# Altium schematic sheet Servos_DC_converter.SchDoc
size A3; SheetNumber: 3; SheetTotal: 6
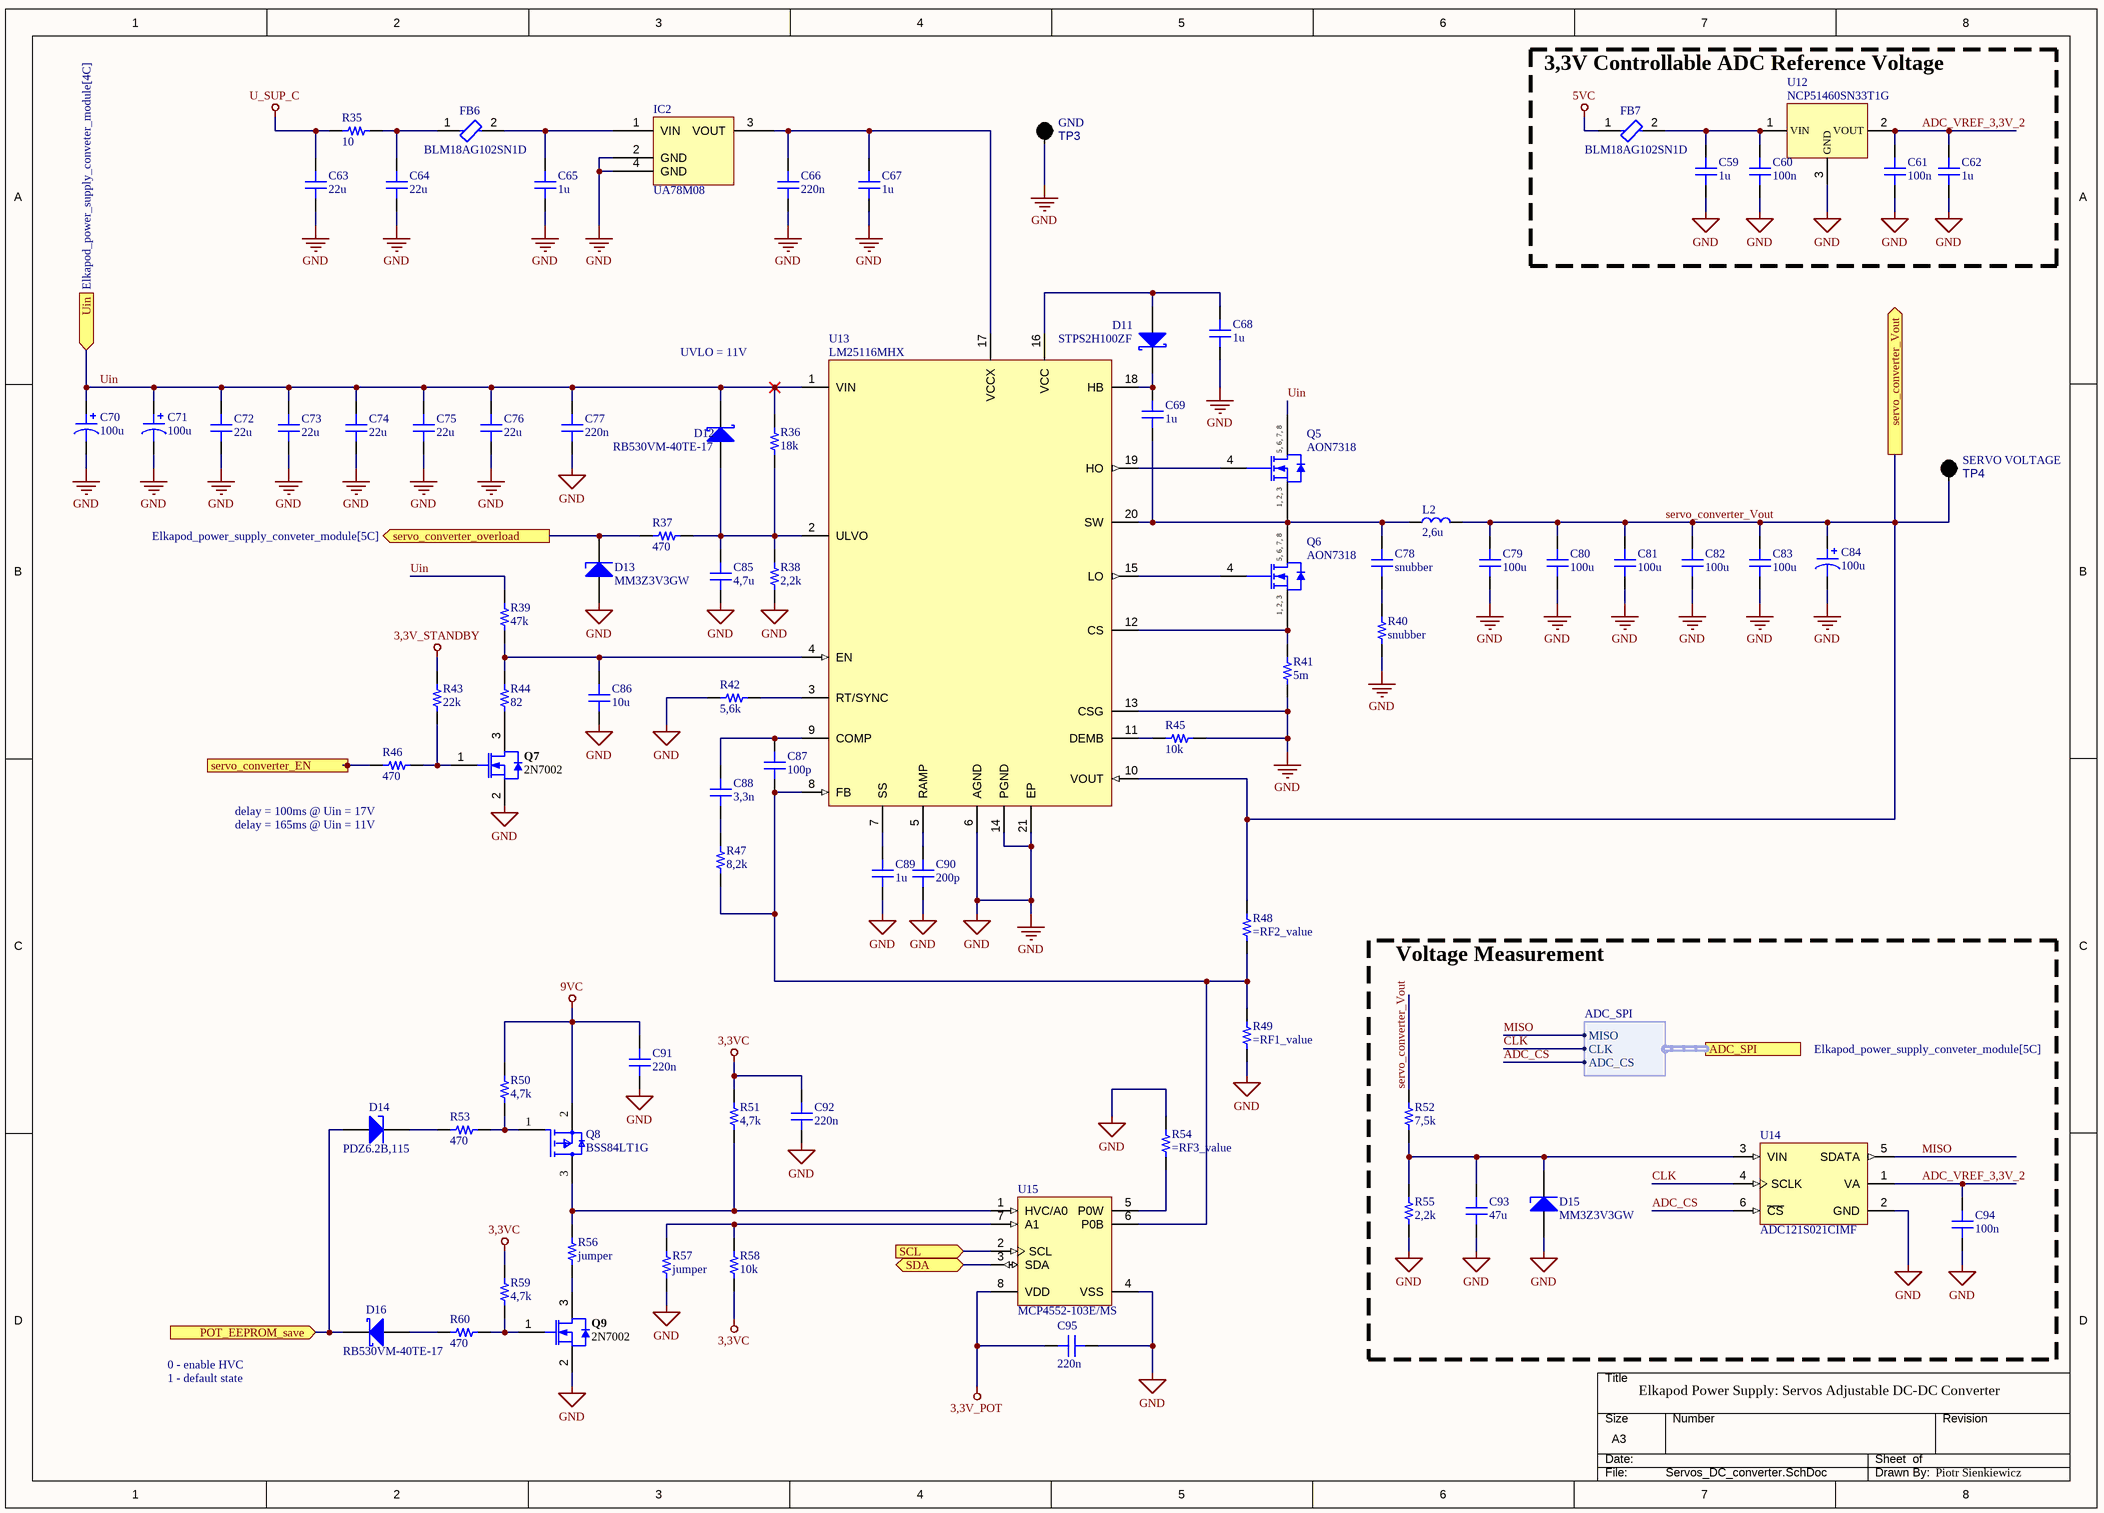
[diagram p0: Servos_DC_converter.SchDoc]

## Parts
C59  1u  [CAP 0603_1608]
C60  100n  [CAP 0603_1608]
C61  100n  [CAP 0603_1608]
C62  1u  [CAP 0603_1608]
C63  22u  [CAP 0805_2012]
C64  22u  [CAP 0805_2012]
C65  1u  [CAP 0603_1608]
C66  220n  [CAP 0603_1608]
C67  1u  [CAP 0603_1608]
C68  1u  [CAP 0603_1608]
C69  1u  [CAP 0603_1608]
C70  100u  [CAP ALSMD 8.3MM H10.5MM]
C71  100u  [CAP ALSMD 8.3MM H10.5MM]
C72  22u  [CAP 0805_2012]
C73  22u  [CAP 0805_2012]
C74  22u  [CAP 0805_2012]
C75  22u  [CAP 0805_2012]
C76  22u  [CAP 0805_2012]
C77  220n  [CAP 0603_1608]
C78  snubber  [CAP 0603_1608]
C79  100u  [CAP 1210_3225 - 1MM]
C80  100u  [CAP 1210_3225 - 1MM]
C81  100u  [CAP 1210_3225 - 1MM]
C82  100u  [CAP 1210_3225 - 1MM]
C83  100u  [CAP 1210_3225 - 1MM]
C84  100u  [CAP ALSMD 8.3MM H10.5MM]
C85  4,7u  [CAP 0603_1608]
C86  10u  [CAP 0603_1608]
C87  100p  [CAP 0603_1608]
C88  3,3n  [CAP 0603_1608]
C89  1u  [CAP 0603_1608]
C90  200p  [CAP 0603_1608]
C91  220n  [CAP 0603_1608]
C92  220n  [CAP 0603_1608]
C93  47u  [CAP 0603_1608]
C94  100n  [CAP 0603_1608]
C95  220n  [CAP 0603_1608]
D11  STPS2H100ZF  [DIOD-SOD-123-2_V]
D12  RB530VM-40TE-17  [SOD-323]
D13  MM3Z3V3GW  [SOD323]
D14  PDZ6.2B,115  [SOD323]
D15  MM3Z3V3GW  [SOD323]
D16  RB530VM-40TE-17  [SOD-323]
FB6  BLM18AG102SN1D  [FP-BLM18-0_15-t0_8-MFG]
FB7  BLM18AG102SN1D  [FP-BLM18-0_15-t0_8-MFG]
IC2  UA78M08  [TI SOT-223 DCY]
L2  2,6u  [18,3x18,2_INDUCTOR]
Q5  AON7318  [DFN3,3x3,3]
Q6  AON7318  [DFN3,3x3,3]
Q7  2N7002  [INF-PG-SOT23_M]
Q8  BSS84LT1G  [FP-318-08-IPC_A]
Q9  2N7002  [INF-PG-SOT23_M]
R35  10  [RES 1206_3216]
R36  18k  [RES 0603_1608]
R37  470  [RES 0603_1608]
R38  2,2k  [RES 0603_1608]
R39  47k  [RES 0603_1608]
R40  snubber  [RES 1206_3216]
R41  5m  [STACKPOLE CSM2512]
R42  5,6k  [RES 0603_1608]
R43  22k  [RES 0603_1608]
R44  82  [RES 0603_1608]
R45  10k  [RES 0603_1608]
R46  470  [RES 0603_1608]
R47  8,2k  [RES 0603_1608]
R48  (no value)  [RES 0603_1608]
R49  (no value)  [RES 0603_1608]
R50  4,7k  [RES 0603_1608]
R51  4,7k  [RES 0603_1608]
R52  7,5k  [RES 0603_1608]
R53  470  [RES 0603_1608]
R54  (no value)  [RES 0603_1608]
R55  2,2k  [RES 0603_1608]
R56  jumper  [RES 0603_1608]
R57  jumper  [RES 0603_1608]
R58  10k  [RES 0603_1608]
R59  4,7k  [RES 0603_1608]
R60  470  [RES 0603_1608]
TP3  GND  [Keystone_5006_BLACK]
TP4  SERVO VOLTAGE  [Keystone_5006_BLACK]
U12  NCP51460SN33T1G  [SOT23-3]
U13  LM25116MHX  [PWP0020A_M]
U14  ADC121S021CIMF  [DBV0006A_M]
U15  MCP4552-103E/MS  [MSOP-MS8_M]

## Blocks framed on the sheet
3,3V Controllable ADC Reference Voltage: C59-C62 FB7 U12
Voltage Measurement: C93 C94 D15 R52 R55 U14

## Ports
ADC_SPI (harness ADC_SPI, see Elkapod_power_supply_conveter_module[5C]), POT_EEPROM_save (in, see Elkapod_power_supply_conveter_module[4C]), SCL (in, see Elkapod_power_supply_conveter_module[4C]), SDA (bidir, see Elkapod_power_supply_conveter_module[4C]), servo_converter_EN (in, see Elkapod_power_supply_conveter_module[4C]), servo_converter_overload (out, see Elkapod_power_supply_conveter_module[5C]), servo_converter_Vout (out, see Elkapod_power_supply_conveter_module[5C]), Uin (in, see Elkapod_power_supply_conveter_module[4C])

## Harnesses
ADC_SPI: MISO, CLK, ADC_CS

## Nets
3,3V_POT: C95.2 U15.8(VDD)
3,3V_STANDBY: R43.1
3,3VC: C92.1 R51.1 R58.2 R59.1
5VC: FB7.1
9VC: C91.1 Q8.2(S) R50.1
GND: C59.1 C60.1 C61.1 C62.1 C63.1 C64.1 C65.1 C66.1 C67.1 C68.2 C70.2 C71.2 C72.1 C73.1 C74.1 C75.1 C76.1 C77.1 C79.1 C80.1 C81.1 C82.1 C83.1 C84.2 C85.1 C86.1 C89.1 C90.1 C91.2 C92.2 C93.1 C94.1 C95.1 D13.1(A) D15.1(A) IC2.2(GND) IC2.4(GND) Q7.2(SOURCE) Q9.2(SOURCE) R38.1 R40.1 R41.1 R42.2 R45.1 R49.2 R54.1 R55.2 R57.2 TP3.0 U12.3(GND) U13.6(AGND) U13.13(CSG) U13.14(PGND) U13.21(EP) U14.2(GND) U15.4(VSS)
U_SUP_C: C63.2 R35.1
ADC_CS: U14.6(~{CS}) ; port ADC_SPI.ADC_CS
ADC_VREF_3,3V_2: C61.2 C62.2 C94.2 U12.2(VOUT) U14.1(VA)
CLK: U14.4(SCLK) ; port ADC_SPI.CLK
MISO: U14.5(SDATA) ; port ADC_SPI.MISO
POT_EEPROM_save: D14.1(A) D16.1(K) ; port POT_EEPROM_save
SCL: U15.2(SCL) ; port SCL
SDA: U15.3(SDA) ; port SDA
servo_converter_EN: R46.1 ; port servo_converter_EN
servo_converter_overload: D13.2(K) R37.2 ; port servo_converter_overload
servo_converter_Vout: C79.2 C80.2 C81.2 C82.2 C83.2 C84.1 L2.2 R48.1 R52.1 TP4.0 U13.10(VOUT) ; port servo_converter_Vout
Uin: C70.1 C71.1 C72.2 C73.2 C74.2 C75.2 C76.2 C77.2 D12.1(K) Q5.5(D) R36.1 R39.1 U13.1(VIN) ; port Uin
NetC59_2: C59.2 C60.2 FB7.2 U12.1(VIN)
NetC64_2: C64.2 FB6.1 R35.2
NetC65_2: C65.2 FB6.2 IC2.1(VIN)
NetC66_2: C66.2 C67.2 IC2.3(VOUT) U13.17(VCCX)
NetC68_1: C68.1 D11.1(A) U13.16(VCC)
NetC69_1: C69.1 C78.2 L2.1 Q5.1(S) Q6.5(D) U13.20(SW)
NetC69_2: C69.2 D11.2(K) U13.18(HB)
NetC78_1: C78.1 R40.2
NetC85_2: C85.2 D12.2(A) R36.2 R37.1 R38.2 U13.2(ULVO)
NetC86_2: C86.2 R39.2 R44.1 U13.4(EN)
NetC87_1: C87.1 C88.1 U13.9(COMP)
NetC87_2: C87.2 R47.2 R48.2 R49.1 U13.8(FB) U15.6(P0B)
NetC88_2: C88.2 R47.1
NetC89_2: C89.2 U13.7(SS)
NetC90_2: C90.2 U13.5(RAMP)
NetC93_2: C93.2 D15.2(K) R52.2 R55.1 U14.3(VIN)
NetD14_2: D14.2(K) R53.2
NetD16_2: D16.2(A) R60.2
NetQ5_4: Q5.4(G) U13.19(HO)
NetQ6_1: Q6.1(S) R41.2 U13.12(CS)
NetQ6_4: Q6.4(G) U13.15(LO)
NetQ7_1: Q7.1(GATE) R43.2 R46.2
NetQ7_3: Q7.3(DRAIN) R44.2
NetQ8_1: Q8.1(G) R50.2 R53.1
NetQ8_3: Q8.3(D) R51.2 R56.1 U15.1(HVC/A0)
NetQ9_1: Q9.1(GATE) R59.2 R60.1
NetQ9_3: Q9.3(DRAIN) R56.2
NetR42_1: R42.1 U13.3(RT/SYNC)
NetR45_2: R45.2 U13.11(DEMB)
NetR54_2: R54.2 U15.5(P0W)
NetR57_1: R57.1 R58.1 U15.7(A1)

## Notes on the sheet
- UVLO = 11V
- (near R46) delay = 100ms @ Uin = 17V
- delay = 165ms @ Uin = 11V
- 0 - enable HVC
- 1 - default state
- Elkapod Power Supply: Servos Adjustable DC-DC Converter
- Piotr Sienkiewicz
- DWG. NO.
- REV.
- SHT.
- THIS DOCUMENT AND THE DATA DISCLOSED HEREIN OR HEREWITH IS THE PROPERTY OF ALTIUM LIMITED AND MAY BE FREELY DISTRIBUTED IN WHOLE. NO RIGHTS ARE RESERVED OR EXPRESS OR IMPLIED WARANTEE GIVEN.
- REVISION
- DESCRIPTION
- DATE
- APPROVED
- ENG:
- APPROVALS
- PROJECT
- DSN:
- CHK:
- REFERENCE DOCUMENTS
- PROJECT REVISION:
- TITLE
- DOCUMENT REVISION:
- DESIGN ITEM:
- BOM:
- FAB DWG:
- PCB DWG:
- ASSY DWG:
- SCALE:
- SIZE
- B
- CAGE CODE
- FILE NAME
- DWG NO.
- SHEET
- OF
- REV
- (in symbol AON7318) 5, 6, 7, 8; 1, 2, 3

## Library data of the parts
C59 C62 C89 = C0603C272F3GAC7867: CAP CER 1uF 16V X5R 0603; manufacturer: KEMET; Temperature Coefficient: C0G, NP0; Tolerance: ±1%; Voltage - Rated: 25V; Part Number: C0603C272F3GAC7867; Value: 1u; Applications: General Purpose; Capacitance: 1u; componentlink1description: Datasheet; componentlink1url: https://api.kemet.com/component-edge/download/datasheet/C0603C272F3GACTU.pdf; componentlink2description: DigiKey Link; componentlink2url: https://www.digikey.com/en/products/detail/kemet/C0603C272F3GAC7867/2200413; Device Package: 0603 (1608 Metric); Features: Low ESL; lastupdated: 09.02.2024 20:10:30; Lifecycle Status: Active; Minimum Order: 1; Mounting Type: Surface Mount, MLCC; Operating Temperature: -55°C ~ 125°C; Package / Case: 0603 (1608 Metric); packaging: TapeAndReel; partid: 2138; Part Status: Active; price: 0.40; series: SMD Comm C0G; Size / Dimension: 0.063" L x 0.031" W (1.60mm x 0.80mm); Thickness (Max): 0.034" (0.87mm)
C60 C61 C94 = C0603C272F3GAC7867: CAP CER 100nF 25V X5R 0603; manufacturer: KEMET; Temperature Coefficient: C0G, NP0; Tolerance: ±1%; Part Number: C0603C272F3GAC7867; Value: 100n; Applications: General Purpose; Capacitance: 100n; componentlink1description: Datasheet; componentlink1url: https://api.kemet.com/component-edge/download/datasheet/C0603C272F3GACTU.pdf; componentlink2description: DigiKey Link; componentlink2url: https://www.digikey.com/en/products/detail/kemet/C0603C272F3GAC7867/2200413; Device Package: 0603 (1608 Metric); Features: Low ESL; lastupdated: 09.02.2024 20:10:30; Lifecycle Status: Active; Minimum Order: 1; Mounting Type: Surface Mount, MLCC; Operating Temperature: -55°C ~ 125°C; Package / Case: 0603 (1608 Metric); packaging: TapeAndReel; partid: 2138; Part Status: Active; price: 0.40; series: SMD Comm C0G; Size / Dimension: 0.063" L x 0.031" W (1.60mm x 0.80mm); Thickness (Max): 0.034" (0.87mm); Voltage - Rated: 25V
C63 C64 C72-C76 = VJ0805Y684KXQTW1BC: CAP CER 22UF 25V X7R 0805; manufacturer: Vishay Vitramon; Tolerance: ±10%; Voltage - Rated: 10V; Part Number: VJ0805Y684KXQTW1BC; Value: 22u; Applications: General Purpose; Capacitance: 22u; componentlink1description: Datasheet; componentlink1url: https://www.vishay.com/docs/28548/vjw1bcbascomseries.pdf; componentlink2description: DigiKey Link; componentlink2url: https://www.digikey.com/en/products/detail/vishay-vitramon/VJ0805Y684KXQTW1BC/8313569; Device Package: 0805 (2012 Metric); lastupdated: 09.02.2024 20:13:13; Lifecycle Status: Active; Minimum Order: 1; Mounting Type: Surface Mount, MLCC; Operating Temperature: -55°C ~ 125°C; Package / Case: 0805 (2012 Metric); packaging: TapeAndReel; partid: 57262; price: 0.05; series: VJ W1BC; Size / Dimension: 0.079" L x 0.049" W (2.00mm x 1.25mm); Temperature Coefficient: X7R; Thickness (Max): 0.053" (1.35mm)
C65 C67-C69 = C0603C272F3GAC7867: CAP CER 1uF 25V X5R 0603; manufacturer: KEMET; Temperature Coefficient: C0G, NP0; Tolerance: ±1%; Part Number: C0603C272F3GAC7867; Value: 1u; Applications: General Purpose; Capacitance: 1u; componentlink1description: Datasheet; componentlink1url: https://api.kemet.com/component-edge/download/datasheet/C0603C272F3GACTU.pdf; componentlink2description: DigiKey Link; componentlink2url: https://www.digikey.com/en/products/detail/kemet/C0603C272F3GAC7867/2200413; Device Package: 0603 (1608 Metric); Features: Low ESL; lastupdated: 09.02.2024 20:10:30; Lifecycle Status: Active; Minimum Order: 1; Mounting Type: Surface Mount, MLCC; Operating Temperature: -55°C ~ 125°C; Package / Case: 0603 (1608 Metric); packaging: TapeAndReel; partid: 2138; Part Status: Active; price: 0.40; series: SMD Comm C0G; Size / Dimension: 0.063" L x 0.031" W (1.60mm x 0.80mm); Thickness (Max): 0.034" (0.87mm); Voltage - Rated: 25V
C66 C77 C91 C92 C95 = C0603C272F3GAC7867: CAP CER 220nF 25V X5R 0603; manufacturer: KEMET; Temperature Coefficient: C0G, NP0; Tolerance: ±1%; Part Number: C0603C272F3GAC7867; Value: 220n; Applications: General Purpose; Capacitance: 220n; componentlink1description: Datasheet; componentlink1url: https://api.kemet.com/component-edge/download/datasheet/C0603C272F3GACTU.pdf; componentlink2description: DigiKey Link; componentlink2url: https://www.digikey.com/en/products/detail/kemet/C0603C272F3GAC7867/2200413; Device Package: 0603 (1608 Metric); Features: Low ESL; lastupdated: 09.02.2024 20:10:30; Lifecycle Status: Active; Minimum Order: 1; Mounting Type: Surface Mount, MLCC; Operating Temperature: -55°C ~ 125°C; Package / Case: 0603 (1608 Metric); packaging: TapeAndReel; partid: 2138; Part Status: Active; price: 0.40; series: SMD Comm C0G; Size / Dimension: 0.063" L x 0.031" W (1.60mm x 0.80mm); Thickness (Max): 0.034" (0.87mm); Voltage - Rated: 25V
C70 C71 C84 = EEE-TC1C101P: UCD1V101MNL1GS; CAP ALUM 100UF 20% 16V SMD; value: 100u
C78 = C0603C272F3GAC7867: CAP CER 50V X5R 0603; manufacturer: KEMET; Temperature Coefficient: C0G, NP0; Tolerance: ±1%; Voltage - Rated: 25V; Part Number: C0603C272F3GAC7867; Value: snubber; Applications: General Purpose; Capacitance: snubber; componentlink1description: Datasheet; componentlink1url: https://api.kemet.com/component-edge/download/datasheet/C0603C272F3GACTU.pdf; componentlink2description: DigiKey Link; componentlink2url: https://www.digikey.com/en/products/detail/kemet/C0603C272F3GAC7867/2200413; Device Package: 0603 (1608 Metric); Features: Low ESL; lastupdated: 09.02.2024 20:10:30; Lifecycle Status: Active; Minimum Order: 1; Mounting Type: Surface Mount, MLCC; Operating Temperature: -55°C ~ 125°C; Package / Case: 0603 (1608 Metric); packaging: TapeAndReel; partid: 2138; Part Status: Active; price: 0.40; series: SMD Comm C0G; Size / Dimension: 0.063" L x 0.031" W (1.60mm x 0.80mm); Thickness (Max): 0.034" (0.87mm)
C79-C83 = CAN13X104KARAC7800: CAP CER 1210 100UF 10V X7R; manufacturer: KEMET; Tolerance: ±10%; Voltage - Rated: 250VAC; Part Number: CAN13X104KARAC7800; Value: 100u; Applications: Boardflex Sensitive; Capacitance: 100u; componentlink1description: Datasheet; componentlink1url: //media.digikey.com/pdf/Data%20Sheets/Kemet%20PDFs/CAN13X104KARACTU_Spec.pdf; componentlink2description: DigiKey Link; componentlink2url: https://www.digikey.com/en/products/detail/kemet/CAN13X104KARAC7800/9962480; Device Package: 1210 (3225 Metric); Features: Low ESL, Soft Termination; lastupdated: 04.06.2024 19:21:07; Lifecycle Status: Active; Minimum Order: 1; Mounting Type: Surface Mount, MLCC; Operating Temperature: -55°C ~ 125°C; Package / Case: 1210 (3225 Metric); packaging: TapeAndReel; partid: 23615; Part Status: Active; price: 0.39; series: CAN SMD Indust X7R; Size / Dimension: 0.130" L x 0.102" W (3.30mm x 2.60mm); Temperature Coefficient: X7R; Thickness (Max): 0.110" (2.80mm)
C85 = C0603C272F3GAC7867: CAP CER 4,7uF 25V X5R 0603; manufacturer: KEMET; Temperature Coefficient: C0G, NP0; Tolerance: ±1%; Part Number: C0603C272F3GAC7867; Value: 4,7u; Applications: General Purpose; Capacitance: 4,7u; componentlink1description: Datasheet; componentlink1url: https://api.kemet.com/component-edge/download/datasheet/C0603C272F3GACTU.pdf; componentlink2description: DigiKey Link; componentlink2url: https://www.digikey.com/en/products/detail/kemet/C0603C272F3GAC7867/2200413; Device Package: 0603 (1608 Metric); Features: Low ESL; lastupdated: 09.02.2024 20:10:30; Lifecycle Status: Active; Minimum Order: 1; Mounting Type: Surface Mount, MLCC; Operating Temperature: -55°C ~ 125°C; Package / Case: 0603 (1608 Metric); packaging: TapeAndReel; partid: 2138; Part Status: Active; price: 0.40; series: SMD Comm C0G; Size / Dimension: 0.063" L x 0.031" W (1.60mm x 0.80mm); Thickness (Max): 0.034" (0.87mm); Voltage - Rated: 25V
C86 = C0603C272F3GAC7867: CAP CER 10uF 35V X5R 0603; manufacturer: KEMET; Temperature Coefficient: C0G, NP0; Tolerance: ±1%; Voltage - Rated: 25V; Part Number: C0603C272F3GAC7867; Value: 10u; Applications: General Purpose; Capacitance: 10u; componentlink1description: Datasheet; componentlink1url: https://api.kemet.com/component-edge/download/datasheet/C0603C272F3GACTU.pdf; componentlink2description: DigiKey Link; componentlink2url: https://www.digikey.com/en/products/detail/kemet/C0603C272F3GAC7867/2200413; Device Package: 0603 (1608 Metric); Features: Low ESL; lastupdated: 09.02.2024 20:10:30; Lifecycle Status: Active; Minimum Order: 1; Mounting Type: Surface Mount, MLCC; Operating Temperature: -55°C ~ 125°C; Package / Case: 0603 (1608 Metric); packaging: TapeAndReel; partid: 2138; Part Status: Active; price: 0.40; series: SMD Comm C0G; Size / Dimension: 0.063" L x 0.031" W (1.60mm x 0.80mm); Thickness (Max): 0.034" (0.87mm)
C87 = C0603C272F3GAC7867: CAP CER 100pF 50V G0C 0603; manufacturer: KEMET; Temperature Coefficient: C0G, NP0; Tolerance: ±1%; Voltage - Rated: 25V; Part Number: C0603C272F3GAC7867; Value: 100p; Applications: General Purpose; Capacitance: 100p; componentlink1description: Datasheet; componentlink1url: https://api.kemet.com/component-edge/download/datasheet/C0603C272F3GACTU.pdf; componentlink2description: DigiKey Link; componentlink2url: https://www.digikey.com/en/products/detail/kemet/C0603C272F3GAC7867/2200413; Device Package: 0603 (1608 Metric); Features: Low ESL; lastupdated: 09.02.2024 20:10:30; Lifecycle Status: Active; Minimum Order: 1; Mounting Type: Surface Mount, MLCC; Operating Temperature: -55°C ~ 125°C; Package / Case: 0603 (1608 Metric); packaging: TapeAndReel; partid: 2138; Part Status: Active; price: 0.40; series: SMD Comm C0G; Size / Dimension: 0.063" L x 0.031" W (1.60mm x 0.80mm); Thickness (Max): 0.034" (0.87mm)
C88 = C0603C272F3GAC7867: CAP CER 3,3nF 50V G0C 0603; manufacturer: KEMET; Temperature Coefficient: C0G, NP0; Tolerance: ±1%; Voltage - Rated: 25V; Part Number: C0603C272F3GAC7867; Value: 3,3n; Applications: General Purpose; Capacitance: 3,3n; componentlink1description: Datasheet; componentlink1url: https://api.kemet.com/component-edge/download/datasheet/C0603C272F3GACTU.pdf; componentlink2description: DigiKey Link; componentlink2url: https://www.digikey.com/en/products/detail/kemet/C0603C272F3GAC7867/2200413; Device Package: 0603 (1608 Metric); Features: Low ESL; lastupdated: 09.02.2024 20:10:30; Lifecycle Status: Active; Minimum Order: 1; Mounting Type: Surface Mount, MLCC; Operating Temperature: -55°C ~ 125°C; Package / Case: 0603 (1608 Metric); packaging: TapeAndReel; partid: 2138; Part Status: Active; price: 0.40; series: SMD Comm C0G; Size / Dimension: 0.063" L x 0.031" W (1.60mm x 0.80mm); Thickness (Max): 0.034" (0.87mm)
C90 = C0603C272F3GAC7867: CAP CER 200pF 50V G0C 0603; manufacturer: KEMET; Temperature Coefficient: C0G, NP0; Tolerance: ±1%; Voltage - Rated: 25V; Part Number: C0603C272F3GAC7867; Value: 200p; Applications: General Purpose; Capacitance: 200p; componentlink1description: Datasheet; componentlink1url: https://api.kemet.com/component-edge/download/datasheet/C0603C272F3GACTU.pdf; componentlink2description: DigiKey Link; componentlink2url: https://www.digikey.com/en/products/detail/kemet/C0603C272F3GAC7867/2200413; Device Package: 0603 (1608 Metric); Features: Low ESL; lastupdated: 09.02.2024 20:10:30; Lifecycle Status: Active; Minimum Order: 1; Mounting Type: Surface Mount, MLCC; Operating Temperature: -55°C ~ 125°C; Package / Case: 0603 (1608 Metric); packaging: TapeAndReel; partid: 2138; Part Status: Active; price: 0.40; series: SMD Comm C0G; Size / Dimension: 0.063" L x 0.031" W (1.60mm x 0.80mm); Thickness (Max): 0.034" (0.87mm)
C93 = C0603C272F3GAC7867: CAP CER 47uF 6,3V X5R 0603; manufacturer: KEMET; Temperature Coefficient: C0G, NP0; Tolerance: ±1%; Voltage - Rated: 25V; Part Number: C0603C272F3GAC7867; Value: 47u; Applications: General Purpose; Capacitance: 47u; componentlink1description: Datasheet; componentlink1url: https://api.kemet.com/component-edge/download/datasheet/C0603C272F3GACTU.pdf; componentlink2description: DigiKey Link; componentlink2url: https://www.digikey.com/en/products/detail/kemet/C0603C272F3GAC7867/2200413; Device Package: 0603 (1608 Metric); Features: Low ESL; lastupdated: 09.02.2024 20:10:30; Lifecycle Status: Active; Minimum Order: 1; Mounting Type: Surface Mount, MLCC; Operating Temperature: -55°C ~ 125°C; Package / Case: 0603 (1608 Metric); packaging: TapeAndReel; partid: 2138; Part Status: Active; price: 0.40; series: SMD Comm C0G; Size / Dimension: 0.063" L x 0.031" W (1.60mm x 0.80mm); Thickness (Max): 0.034" (0.87mm)
D11 = CMP-0303-00004-1: Schottky diode; 2A; 100V
D12 D16 = BAS140W: Schottky diode; 0,1A; 40V; Published: 21-Mar-2003; LatestRevisionDate: 19-Mar-2004; LatestRevisionNote: Silkscreen size reduced.; DatasheetDocument: Oct-1999; PackageDocument: Sep-2000; PackageReference: SOD-323; Publisher: Altium Limited; ComponentLink1Description: Manufacturer Link; ComponentLink1URL: http://www.infineon.com/; ComponentLink2Description: Datasheet; ComponentLink2URL: http://www.infineon.com/upload/Document/cmc_upload/documents/009/386/bas70_bas170series_1.pdf
D13 D15 = Zener_Diode_SOD323: 3,3V, 0,3W Zener diode; SOD323
D14 = Zener_Diode_SOD323: 6,2V, 0,4W Zener diode
FB6 FB7 = CMP-0686-00457-3: Chip Ferrite Bead, 0603, 1000Ω @ 100MHz, 0.5Ω, 25%, 450mA; Number of Circuits: 1; Max DC Current: 400mA; Shielding: Unshielded; DC Resistance (DCR): 500mR; Material: Steel; DC Resistance-Max: 700mR; Impedance: 1kR; Case Code (Imperial): 0603; Max Current Rating: 400mA; Frequency: 100MHz; Min Operating Temperature: -55°C; Case/Package: 0603; Depth: 0.8mm; Lead Free: Lead Free; Core Material: Ferrite; Current Rating: 400mA; Resistance: 500mR; Case Code (Metric): 1608; DC Current: 400mA; Package Quantity: 1; Packaging: Tape and Reel; Width: 0.8mm; Military Standard: Not; Height: 0.8mm; Series: BLM18A; Max Operating Temperature: 125°C; Tolerance: 25%; Termination: SMD/SMT; Test Frequency: 100MHz; Number of Lines: 1; Number of Pins: 2; REACH SVHC: No SVHC; Length: 1.6mm; Radiation Hardening: No
IC2 = LM340MP-5.0/NOPB: IC REG LINEAR 8V 0,5A SOT223; Manufacturer: Texas Instruments; Current - Output: 1.5A; Number of Regulators: 1; Output Configuration: Positive; Output Type: Fixed; Part Number: UA78M08; ComponentLink1Description: Datasheet; ComponentLink1URL: http://www.ti.com/general/docs/suppproductinfo.tsp?distId=10&gotoUrl=http%3A%2F%2Fwww.ti.com%2Flit%2Fgpn%2Flm340; ComponentLink2Description: DigiKey Link; ComponentLink2URL: //digikey.com/product-detail/en/texas-instruments/LM340MP-5.0-NOPB/LM340MP-5.0-NOPBTR-ND/270717; Lifecycle Status: 0; Operating Temperature: 0°C ~ 125°C; Package / Case: TO-261-4, TO-261AA; Packaging: TapeAndReel; Voltage - Output (Min/Fixed): 8V
L2 = 18,3x18,2_INDUCTOR: Power inductor, 2,6uH, Imax = 25,5A, Isat = 50A
Q5 Q6 = AON7318: Ultra Fast N-MOSFET; 50A; 30V; DFN3,3x3,3
Q7 Q9 = CMP-1149-00026-1: N-Channel OptiMOS Small-Signal-Transistor, 60 V VDS, 0.3 A ID, -55 to 150 degC, PG-SOT23, Reel, Green; Manufacturer: Infineon; RDS (on) (max) (@4.5V): 4,000 mOhm; VDS (max): 60 V; IDpuls (max): 1.2Â A; QG: 0.4Â nC; RDS (on) (max): 3,000 mOhm; RthJA (max): 250 K/W; ID (max): 0.3Â A; VGS(th) (max): 2.5Â V; VGS(th) (min): 1.5Â V; Green: TRUE; Ptot (max): 0.5Â W; PackageDescription: 3-Pin Small Outline Transistor Package, 2.9 x 1.3 mm Body, 0.95 mm Pitch; Halogen-free: TRUE; ComponentLink2Description: Datasheet; ComponentLink1URL: http://www.infineon.com/; Packing: Reel; DatasheetVersion: Rev. 2.4; PartNumber: 2N7002; PackageReference: PG-SOT23; PackageVersion: Apr-08; ComponentLink3URL: http://www.infineon.com/dgdl/SOT23-Package_Overview.pdf?folderId=db3a30431936bc4b0119532290053c66&fileId=db3a30431936bc4b0119533468123c85; ComponentLink1Description: Manufacturer URL; Mounting Technology: Surface Mount; ComponentLink3Description: Package Specification; ComponentLink2URL: http://www.infineon.com/dgdl/2N7002_Rev2.4.pdf?folderId=db3a3043156fd573011622e10b5c1f67&fileId=db3a304319bc939a0119c2a9461e79e6
Q8 = CMP-1058-00762-2: MOSFET P-CH 50V 130MA SOT-23; Max Power Dissipation: 225mW; On-State Resistance: 10R; Nominal Vgs: 2V; Gate to Source Voltage (Vgs): 20V; Rise Time: 1ns; Turn-Off Delay Time: 16ns; Voltage Rating (DC): -50V; Turn-On Delay Time: 3.6ns; Number of Elements: 1; Current Rating: -130mA; Input Capacitance: 30pF; Threshold Voltage: -2V; Element Configuration: Single; Drain to Source Breakdown Voltage: 50V; Continuous Drain Current (ID): 130mA; Length: 0.119inch; Drain to Source Voltage (Vdss): 50V; Min Operating Temperature: -55°C; Contact Plating: Tin; Lead Free: Lead Free; Width: 0.055inch; Case/Package: SOT-23-3; Max Operating Temperature: 150°C; Halogen Free: Halogen Free; Radiation Hardening: No; Drain to Source Resistance: 10R; REACH SVHC: No SVHC; Power Dissipation: 225mW; Number of Pins: 3; Package Quantity: 1; Packaging: Tape and Reel; Fall Time: 1ns; Rds On Max: 10R; Height: 0.04inch
R35 = KRL1632E-M-R120-F-T5: RES 10 OHM 1% 3/4W 1206; Manufacturer: Susumu; Power (Watts): 0.75W, 3/4W; Temperature Coefficient: ±50ppm/°C; Part Number: KRL1632E-M-R120-F-T5; ComponentLink1Description: Datasheet; ComponentLink1URL: http://www.susumu.co.jp/common/pdf/n_catalog_partition09_en.pdf; ComponentLink2Description: DigiKey Link; ComponentLink2URL: https://www.digikey.com/en/products/detail/susumu/KRL1632E-M-R120-F-T5/3738009; Composition: Metal Foil; Device Package: 1206 (3216 Metric); Features: Automotive AEC-Q200, Current Sense; Height - Seated (Max): 0.028" (0.70mm); LastUpdated: 09.02.2024 20:54:46; Lifecycle Status: Active; Minimum Order: 1; Number of Terminations: 2; Operating Temperature: -55°C ~ 155°C; Package / Case: 1206 (3216 Metric); Packaging: TapeAndReel; PartId: 26840; Part Status: Active; Price: 0.09; Ratings: AEC-Q200; Resistance: 10; Series: KRL; Size / Dimension: 0.126" L x 0.063" W (3.20mm x 1.60mm); Supplier Device Package: 1206; Tolerance: ±1%; Value: 10
R36 = RNCS0603BKE10K0: RES 18K OHM 1% 0,1W 0603; Manufacturer: Stackpole Electronics Inc; Power (Watts): 0.063W, 1/16W; Temperature Coefficient: ±25ppm/°C; Tolerance: ±0.1%; Part Number: RNCS0603BKE10K0; Value: 18k; Composition: Thin Film; Device Package: 0603 (1608 Metric); Features: Anti-Corrosive, Automotive AEC-Q200, Moisture Resistant; Height - Seated (Max): 0.022" (0.55mm); LastUpdated: 09.02.2024 20:43:37; Lifecycle Status: Active; Minimum Order: 1; Number of Terminations: 2; Operating Temperature: -55°C ~ 155°C; Package / Case: 0603 (1608 Metric); Packaging: TapeAndReel; PartId: 4838; Part Status: Active; Price: 0.06; Ratings: AEC-Q200; Resistance: 18k; Series: RNCS; Size / Dimension: 0.061" L x 0.031" W (1.55mm x 0.80mm); Supplier Device Package: 0603
R37 R46 R53 R60 = RNCS0603BKE10K0: RES 470 OHM 1% 0,1W 0603; Manufacturer: Stackpole Electronics Inc; Power (Watts): 0.063W, 1/16W; Temperature Coefficient: ±25ppm/°C; Tolerance: ±0.1%; Part Number: RNCS0603BKE10K0; Value: 470; Composition: Thin Film; Device Package: 0603 (1608 Metric); Features: Anti-Corrosive, Automotive AEC-Q200, Moisture Resistant; Height - Seated (Max): 0.022" (0.55mm); LastUpdated: 09.02.2024 20:43:37; Lifecycle Status: Active; Minimum Order: 1; Number of Terminations: 2; Operating Temperature: -55°C ~ 155°C; Package / Case: 0603 (1608 Metric); Packaging: TapeAndReel; PartId: 4838; Part Status: Active; Price: 0.06; Ratings: AEC-Q200; Resistance: 470; Series: RNCS; Size / Dimension: 0.061" L x 0.031" W (1.55mm x 0.80mm); Supplier Device Package: 0603
R38 R55 = RNCS0603BKE10K0: RES 2,2K OHM 1% 0,1W 0603; Manufacturer: Stackpole Electronics Inc; Power (Watts): 0.063W, 1/16W; Temperature Coefficient: ±25ppm/°C; Tolerance: ±0.1%; Part Number: RNCS0603BKE10K0; Value: 2,2k; Composition: Thin Film; Device Package: 0603 (1608 Metric); Features: Anti-Corrosive, Automotive AEC-Q200, Moisture Resistant; Height - Seated (Max): 0.022" (0.55mm); LastUpdated: 09.02.2024 20:43:37; Lifecycle Status: Active; Minimum Order: 1; Number of Terminations: 2; Operating Temperature: -55°C ~ 155°C; Package / Case: 0603 (1608 Metric); Packaging: TapeAndReel; PartId: 4838; Part Status: Active; Price: 0.06; Ratings: AEC-Q200; Resistance: 2,2k; Series: RNCS; Size / Dimension: 0.061" L x 0.031" W (1.55mm x 0.80mm); Supplier Device Package: 0603
R39 = RNCS0603BKE10K0: RES 47K OHM 1% 0,1W 0603; Manufacturer: Stackpole Electronics Inc; Power (Watts): 0.063W, 1/16W; Temperature Coefficient: ±25ppm/°C; Tolerance: ±0.1%; Part Number: RNCS0603BKE10K0; Value: 47k; Composition: Thin Film; Device Package: 0603 (1608 Metric); Features: Anti-Corrosive, Automotive AEC-Q200, Moisture Resistant; Height - Seated (Max): 0.022" (0.55mm); LastUpdated: 09.02.2024 20:43:37; Lifecycle Status: Active; Minimum Order: 1; Number of Terminations: 2; Operating Temperature: -55°C ~ 155°C; Package / Case: 0603 (1608 Metric); Packaging: TapeAndReel; PartId: 4838; Part Status: Active; Price: 0.06; Ratings: AEC-Q200; Resistance: 47k; Series: RNCS; Size / Dimension: 0.061" L x 0.031" W (1.55mm x 0.80mm); Supplier Device Package: 0603
R40 = KRL1632E-M-R120-F-T5: Manufacturer: Susumu; Power (Watts): 0.75W, 3/4W; Temperature Coefficient: ±50ppm/°C; Tolerance: ±1%; Part Number: KRL1632E-M-R120-F-T5; Composition: Metal Foil; Device Package: 1206 (3216 Metric); Features: Automotive AEC-Q200, Current Sense; Height - Seated (Max): 0.028" (0.70mm); LastUpdated: 09.02.2024 20:54:46; Lifecycle Status: Active; Minimum Order: 1; Number of Terminations: 2; Operating Temperature: -55°C ~ 155°C; Package / Case: 1206 (3216 Metric); Packaging: TapeAndReel; PartId: 26840; Part Status: Active; Price: 0.09; Ratings: AEC-Q200; Resistance: snubber; Series: KRL; Size / Dimension: 0.126" L x 0.063" W (3.20mm x 1.60mm); Supplier Device Package: 1206; Value: snubber
R41 = CSM2512FT20L0: RES 0,005 OHM 1% 3W 2512; manufacturer: Stackpole Electronics Inc; Temperature Coefficient: ±50ppm/°C; value: 20 mOhms; Part Number: CSM2512FT20L0; componentlink1description: Datasheet; componentlink1url: https://www.seielect.com/Catalog/SEI-CSM.PDF; componentlink2description: DigiKey Link; componentlink2url: https://www.digikey.com/en/products/detail/stackpole-electronics-inc/CSM2512FT20L0/6270239; Composition: Metal Element; Device Package: 2512 (6332 Metric); Features: Current Sense; Height - Seated (Max): 0.035" (0.90mm); lastupdated: 03.06.2024 20:27:03; Lifecycle Status: Active; Minimum Order: 4000; Number of Terminations: 2; Operating Temperature: -55°C ~ 170°C; Package / Case: 2512 (6332 Metric); packaging: TapeAndReel; Part Status: Active; Power (Watts): 3W; price: 0.19; Resistance: 5m; series: CSM; Size / Dimension: 0.252" L x 0.126" W (6.40mm x 3.20mm); Supplier Device Package: 2512; Tolerance: ±1%
R42 = RNCS0603BKE10K0: RES 5,6K OHM 1% 0,1W 0603; Manufacturer: Stackpole Electronics Inc; Power (Watts): 0.063W, 1/16W; Temperature Coefficient: ±25ppm/°C; Tolerance: ±0.1%; Part Number: RNCS0603BKE10K0; Value: 5,6k; Composition: Thin Film; Device Package: 0603 (1608 Metric); Features: Anti-Corrosive, Automotive AEC-Q200, Moisture Resistant; Height - Seated (Max): 0.022" (0.55mm); LastUpdated: 09.02.2024 20:43:37; Lifecycle Status: Active; Minimum Order: 1; Number of Terminations: 2; Operating Temperature: -55°C ~ 155°C; Package / Case: 0603 (1608 Metric); Packaging: TapeAndReel; PartId: 4838; Part Status: Active; Price: 0.06; Ratings: AEC-Q200; Resistance: 5,6k; Series: RNCS; Size / Dimension: 0.061" L x 0.031" W (1.55mm x 0.80mm); Supplier Device Package: 0603
R43 = RNCS0603BKE10K0: RES 22K OHM 1% 0,1W 0603; Manufacturer: Stackpole Electronics Inc; Power (Watts): 0.063W, 1/16W; Temperature Coefficient: ±25ppm/°C; Tolerance: ±0.1%; Part Number: RNCS0603BKE10K0; Value: 22k; Composition: Thin Film; Device Package: 0603 (1608 Metric); Features: Anti-Corrosive, Automotive AEC-Q200, Moisture Resistant; Height - Seated (Max): 0.022" (0.55mm); LastUpdated: 09.02.2024 20:43:37; Lifecycle Status: Active; Minimum Order: 1; Number of Terminations: 2; Operating Temperature: -55°C ~ 155°C; Package / Case: 0603 (1608 Metric); Packaging: TapeAndReel; PartId: 4838; Part Status: Active; Price: 0.06; Ratings: AEC-Q200; Resistance: 22k; Series: RNCS; Size / Dimension: 0.061" L x 0.031" W (1.55mm x 0.80mm); Supplier Device Package: 0603
R44 = RNCS0603BKE10K0: RES 82 OHM 1% 0,1W 0603; Manufacturer: Stackpole Electronics Inc; Power (Watts): 0.063W, 1/16W; Temperature Coefficient: ±25ppm/°C; Tolerance: ±0.1%; Part Number: RNCS0603BKE10K0; Value: 82; Composition: Thin Film; Device Package: 0603 (1608 Metric); Features: Anti-Corrosive, Automotive AEC-Q200, Moisture Resistant; Height - Seated (Max): 0.022" (0.55mm); LastUpdated: 09.02.2024 20:43:37; Lifecycle Status: Active; Minimum Order: 1; Number of Terminations: 2; Operating Temperature: -55°C ~ 155°C; Package / Case: 0603 (1608 Metric); Packaging: TapeAndReel; PartId: 4838; Part Status: Active; Price: 0.06; Ratings: AEC-Q200; Resistance: 82; Series: RNCS; Size / Dimension: 0.061" L x 0.031" W (1.55mm x 0.80mm); Supplier Device Package: 0603
R45 R58 = RNCS0603BKE10K0: RES 10K OHM 1% 0,1W 0603; Manufacturer: Stackpole Electronics Inc; Power (Watts): 0.063W, 1/16W; Temperature Coefficient: ±25ppm/°C; Tolerance: ±0.1%; Part Number: RNCS0603BKE10K0; Value: 10k; Composition: Thin Film; Device Package: 0603 (1608 Metric); Features: Anti-Corrosive, Automotive AEC-Q200, Moisture Resistant; Height - Seated (Max): 0.022" (0.55mm); LastUpdated: 09.02.2024 20:43:37; Lifecycle Status: Active; Minimum Order: 1; Number of Terminations: 2; Operating Temperature: -55°C ~ 155°C; Package / Case: 0603 (1608 Metric); Packaging: TapeAndReel; PartId: 4838; Part Status: Active; Price: 0.06; Ratings: AEC-Q200; Resistance: 10k; Series: RNCS; Size / Dimension: 0.061" L x 0.031" W (1.55mm x 0.80mm); Supplier Device Package: 0603
R47 = RNCS0603BKE10K0: RES 8,2K OHM 1% 0,1W 0603; Manufacturer: Stackpole Electronics Inc; Power (Watts): 0.063W, 1/16W; Temperature Coefficient: ±25ppm/°C; Tolerance: ±0.1%; Part Number: RNCS0603BKE10K0; Value: 8,2k; Composition: Thin Film; Device Package: 0603 (1608 Metric); Features: Anti-Corrosive, Automotive AEC-Q200, Moisture Resistant; Height - Seated (Max): 0.022" (0.55mm); LastUpdated: 09.02.2024 20:43:37; Lifecycle Status: Active; Minimum Order: 1; Number of Terminations: 2; Operating Temperature: -55°C ~ 155°C; Package / Case: 0603 (1608 Metric); Packaging: TapeAndReel; PartId: 4838; Part Status: Active; Price: 0.06; Ratings: AEC-Q200; Resistance: 8,2k; Series: RNCS; Size / Dimension: 0.061" L x 0.031" W (1.55mm x 0.80mm); Supplier Device Package: 0603
R48 = RNCS0603BKE10K0: RES {=RF2_value} OHM 1% 0,1W 0603; Manufacturer: Stackpole Electronics Inc; Power (Watts): 0.063W, 1/16W; Temperature Coefficient: ±25ppm/°C; Tolerance: ±0.1%; Part Number: RNCS0603BKE10K0; Value: =RF2_value; Composition: Thin Film; Device Package: 0603 (1608 Metric); Features: Anti-Corrosive, Automotive AEC-Q200, Moisture Resistant; Height - Seated (Max): 0.022" (0.55mm); LastUpdated: 09.02.2024 20:43:37; Lifecycle Status: Active; Minimum Order: 1; Number of Terminations: 2; Operating Temperature: -55°C ~ 155°C; Package / Case: 0603 (1608 Metric); Packaging: TapeAndReel; PartId: 4838; Part Status: Active; Price: 0.06; Ratings: AEC-Q200; Resistance: =RF2_value; Series: RNCS; Size / Dimension: 0.061" L x 0.031" W (1.55mm x 0.80mm); Supplier Device Package: 0603
R49 = RNCS0603BKE10K0: RES {=RF1_value} OHM 1% 0,1W 0603; Manufacturer: Stackpole Electronics Inc; Power (Watts): 0.063W, 1/16W; Temperature Coefficient: ±25ppm/°C; Tolerance: ±0.1%; Part Number: RNCS0603BKE10K0; Value: =RF1_value; Composition: Thin Film; Device Package: 0603 (1608 Metric); Features: Anti-Corrosive, Automotive AEC-Q200, Moisture Resistant; Height - Seated (Max): 0.022" (0.55mm); LastUpdated: 09.02.2024 20:43:37; Lifecycle Status: Active; Minimum Order: 1; Number of Terminations: 2; Operating Temperature: -55°C ~ 155°C; Package / Case: 0603 (1608 Metric); Packaging: TapeAndReel; PartId: 4838; Part Status: Active; Price: 0.06; Ratings: AEC-Q200; Resistance: =RF1_value; Series: RNCS; Size / Dimension: 0.061" L x 0.031" W (1.55mm x 0.80mm); Supplier Device Package: 0603
R50 R51 R59 = RNCS0603BKE10K0: RES 4,7K OHM 1% 0,1W 0603; Manufacturer: Stackpole Electronics Inc; Power (Watts): 0.063W, 1/16W; Temperature Coefficient: ±25ppm/°C; Tolerance: ±0.1%; Part Number: RNCS0603BKE10K0; Value: 4,7k; Composition: Thin Film; Device Package: 0603 (1608 Metric); Features: Anti-Corrosive, Automotive AEC-Q200, Moisture Resistant; Height - Seated (Max): 0.022" (0.55mm); LastUpdated: 09.02.2024 20:43:37; Lifecycle Status: Active; Minimum Order: 1; Number of Terminations: 2; Operating Temperature: -55°C ~ 155°C; Package / Case: 0603 (1608 Metric); Packaging: TapeAndReel; PartId: 4838; Part Status: Active; Price: 0.06; Ratings: AEC-Q200; Resistance: 4,7k; Series: RNCS; Size / Dimension: 0.061" L x 0.031" W (1.55mm x 0.80mm); Supplier Device Package: 0603
R52 = RNCS0603BKE10K0: RES 7,5K OHM 1% 0,1W 0603; Manufacturer: Stackpole Electronics Inc; Power (Watts): 0.063W, 1/16W; Temperature Coefficient: ±25ppm/°C; Tolerance: ±0.1%; Part Number: RNCS0603BKE10K0; Value: 7,5k; Composition: Thin Film; Device Package: 0603 (1608 Metric); Features: Anti-Corrosive, Automotive AEC-Q200, Moisture Resistant; Height - Seated (Max): 0.022" (0.55mm); LastUpdated: 09.02.2024 20:43:37; Lifecycle Status: Active; Minimum Order: 1; Number of Terminations: 2; Operating Temperature: -55°C ~ 155°C; Package / Case: 0603 (1608 Metric); Packaging: TapeAndReel; PartId: 4838; Part Status: Active; Price: 0.06; Ratings: AEC-Q200; Resistance: 7,5k; Series: RNCS; Size / Dimension: 0.061" L x 0.031" W (1.55mm x 0.80mm); Supplier Device Package: 0603
R54 = RNCS0603BKE10K0: RES {=RF3_value} OHM 1% 0,1W 0603; Manufacturer: Stackpole Electronics Inc; Power (Watts): 0.063W, 1/16W; Temperature Coefficient: ±25ppm/°C; Tolerance: ±0.1%; Part Number: RNCS0603BKE10K0; Value: =RF3_value; Composition: Thin Film; Device Package: 0603 (1608 Metric); Features: Anti-Corrosive, Automotive AEC-Q200, Moisture Resistant; Height - Seated (Max): 0.022" (0.55mm); LastUpdated: 09.02.2024 20:43:37; Lifecycle Status: Active; Minimum Order: 1; Number of Terminations: 2; Operating Temperature: -55°C ~ 155°C; Package / Case: 0603 (1608 Metric); Packaging: TapeAndReel; PartId: 4838; Part Status: Active; Price: 0.06; Ratings: AEC-Q200; Resistance: =RF3_value; Series: RNCS; Size / Dimension: 0.061" L x 0.031" W (1.55mm x 0.80mm); Supplier Device Package: 0603
R56 R57 = RNCS0603BKE10K0: RES 0 OHM 1% 0,1W 0603; Manufacturer: Stackpole Electronics Inc; Power (Watts): 0.063W, 1/16W; Temperature Coefficient: ±25ppm/°C; Tolerance: ±0.1%; Part Number: RNCS0603BKE10K0; Value: jumper; Composition: Thin Film; Device Package: 0603 (1608 Metric); Features: Anti-Corrosive, Automotive AEC-Q200, Moisture Resistant; Height - Seated (Max): 0.022" (0.55mm); LastUpdated: 09.02.2024 20:43:37; Lifecycle Status: Active; Minimum Order: 1; Number of Terminations: 2; Operating Temperature: -55°C ~ 155°C; Package / Case: 0603 (1608 Metric); Packaging: TapeAndReel; PartId: 4838; Part Status: Active; Price: 0.06; Ratings: AEC-Q200; Resistance: jumper; Series: RNCS; Size / Dimension: 0.061" L x 0.031" W (1.55mm x 0.80mm); Supplier Device Package: 0603
TP3 TP4 = Keystone 5006 Test Point: Keystone 5006 Test Point (BLACK)
U12 = NCP51460SN33T1G: Low power precision voltage reference; Iout = 20mA
U13 = LM25116MHX: Wide Range Synchronous Buck Controller, 20-pin TSSOP-EP, Pb-Free
U14 = CMP-0054-00268-3: Single Channel, 50 to 200 kSPS, 12-Bit A/D Converter, 6-pin SOT-23; Manufacturer: Texas Instruments; PackageTopMarking: X07C*XTT; CompType: ADC IC; PowerWise: Y; Code_IPC: SOT26A-6; PackageReference: DBV0006A; ComponentLink1Description: Datasheet URL; PinCount: 6; ComponentLink1URL: http://www.ti.com/general/docs/lit/getliterature.tsp?genericPartNumber=ADC121S021&fileType=pdf; PackageDescription: Molded SOT-23, .115 x .063 x .040in Body, 6 Lead, .0375in in Pitch; RoHS: N; Code_JEDEC: MO-178-AB
U15 = CMP-0188-00830-2: 8-Bit Single I2C Digital POT with Volatile Memory, 8-pin MSOP, Extended Temperature; RevisionNote: URLs added.; DatasheetVersion: revA, Nov-2008; ComponentLink2URL: http://ww1.microchip.com/downloads/en/DeviceDoc/DS-22096a.pdf; ComponentLink2Description: Datasheet; PackageVersion: revBB, Aug-2009; ComponentLink1Description: Manufacturer URL; ComponentLink3Description: Package Specification; PackageDescription: 8-Lead Plastic Micro Small Outline Package (MS) [MSOP]; PackageReference: MSOP-MS8; ComponentLink3URL: http://www.microchip.com/stellent/groups/techpub_sg/documents/packagingspec/en012702.pdf; ComponentLink1URL: http://www.microchip.com/